# Altium schematic sheet Bridge.SchDoc: FER_TEMPLATE
size A4; Author: Leon Baždar; CompanyName: FER; Address1: Zagreb; SheetNumber: 5; SheetTotal: 5
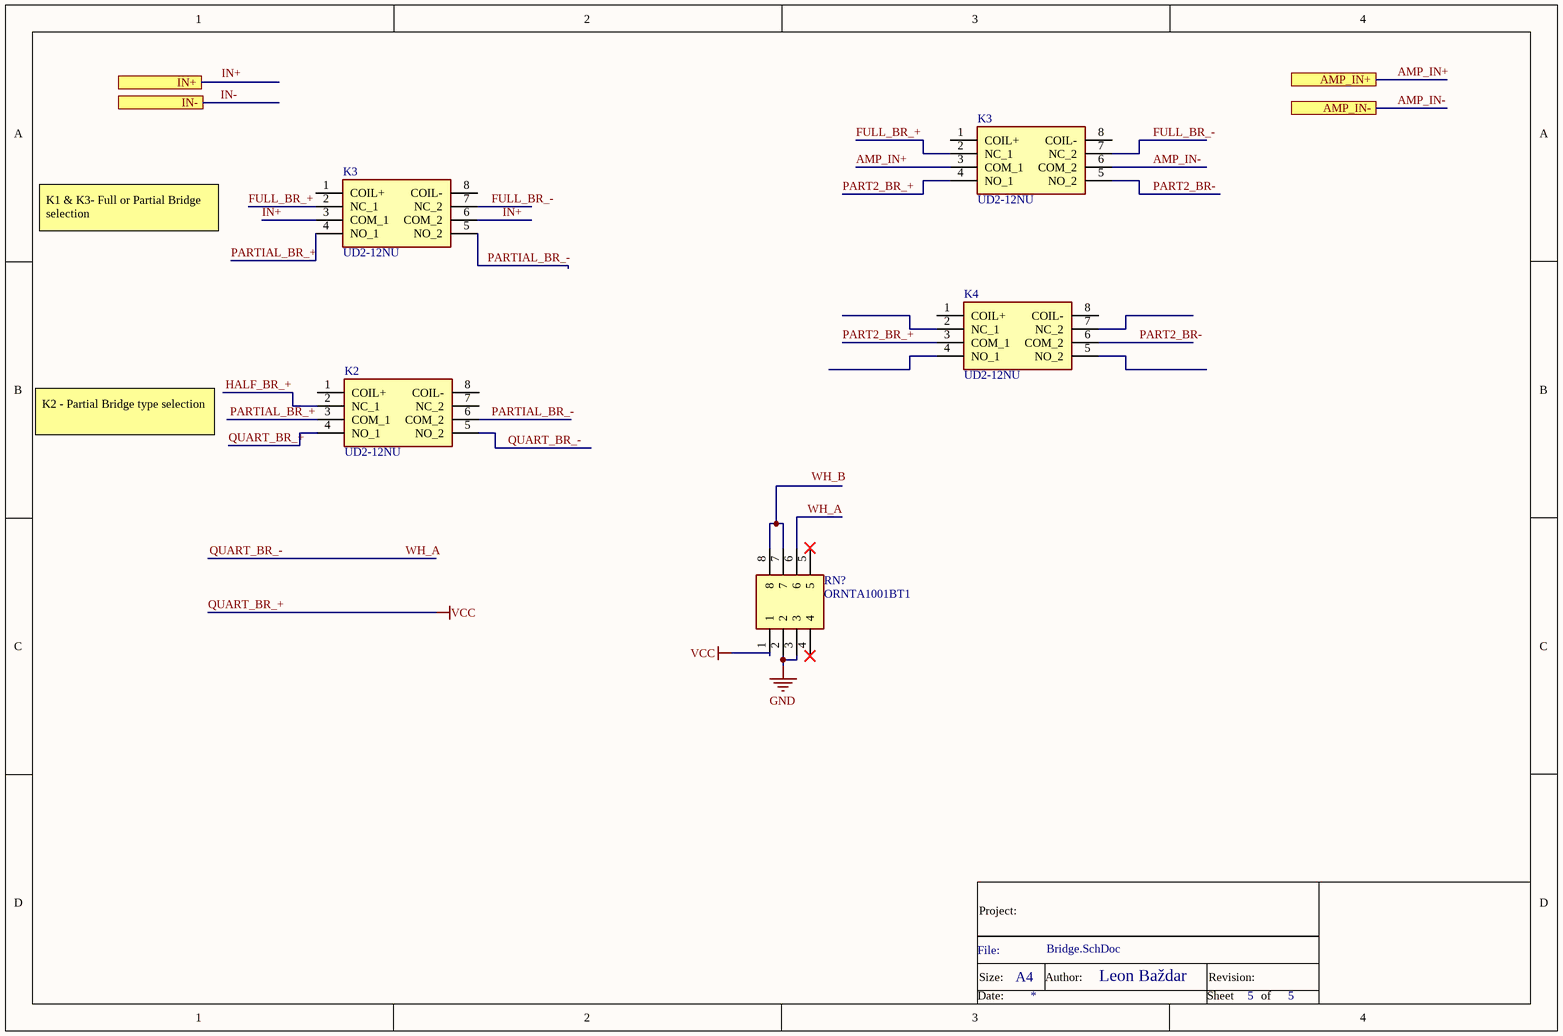
[diagram p0: Bridge.SchDoc]

## Parts
(Parts that share a designator on the sheet are numbered #1, #2 ... from top to bottom, then left to right.)
K2  UD2-12NU  [UD212NU]
K3#1  UD2-12NU  [UD212NU]
K3#2  UD2-12NU  [UD212NU]
K4  UD2-12NU  [UD212NU]
RN?  ORNTA1001BT1  [SOIC127P607X173-8N]

## Ports
AMP_IN+, AMP_IN-, IN+, IN-

## Nets
GND: RN?.2 RN?.3
QUART_BR_+: K2.4(NO_1) RN?.1  [also labelled VCC]
AMP_IN+: K3#1.3(COM_1) ; port AMP_IN+
AMP_IN-: K3#1.6(COM_2) ; port AMP_IN-
FULL_BR_+: K3#1.2(NC_1) K3#2.2(NC_1)
FULL_BR_-: K3#1.7(NC_2) K3#2.7(NC_2)
HALF_BR_+: K2.2(NC_1)
IN+: K3#2.3(COM_1) K3#2.6(COM_2)
IN-: port IN-
PART2_BR-: K3#1.5(NO_2) K4.6(COM_2)
PART2_BR_+: K3#1.4(NO_1) K4.3(COM_1)
PARTIAL_BR_+: K2.3(COM_1) K3#2.4(NO_1)
PARTIAL_BR_-: K2.6(COM_2) K3#2.5(NO_2)
QUART_BR_-: K2.5(NO_2) RN?.6  [also labelled WH_A]
NetRN?_7: RN?.7 RN?.8

Not connected (* = marked no-connect by the designer): K2 1(COIL+) 7(NC_2) 8(COIL-); K3#1 1(COIL+) 8(COIL-); K3#2 1(COIL+) 8(COIL-); K4 1(COIL+) 2(NC_1) 4(NO_1) 5(NO_2) 7(NC_2) 8(COIL-); RN? 4* 5*

## Notes on the sheet
- K1 & K3- Full or Partial Bridge selection
- K2 - Partial Bridge type selection
- Labels drawn without touching a wire or pin: IN+, WH_B
- Project:
- File:
- Size:
- A4
- Author:
- Revision:
- Date:
- Sheet
- of

## Library data of the parts
K2 K3#1 K3#2 K4 = UD2-12NU: Relay or Contactor; Manufacturer_Name: Kemet; Datasheet Link: https://datasheet.datasheetarchive.com/originals/dk/DKDS-28/541685.pdf; Height: 5.45mm; Manufacturer_Part_Number: UD2-12NU
RN? = ORNTA1001BT1: Resistor Network; Manufacturer_Name: Vishay; Datasheet Link: https://www.vishay.com/docs/60005/orn.pdf; Height: 1.73mm; Manufacturer_Part_Number: ORNTA1001BT1; Mouser Part Number: 71-ORNTA1001BT1; Mouser Price/Stock: https://www.mouser.co.uk/ProductDetail/Vishay-Thin-Film/ORNTA1001BT1?qs=EiQZnNXpF8A9ZYJTqcYggA%3D%3D